# Altium schematic sheet BatteryCharger.SchDoc
size 420 x 297 mm; SheetNumber: 3; SheetTotal: 3
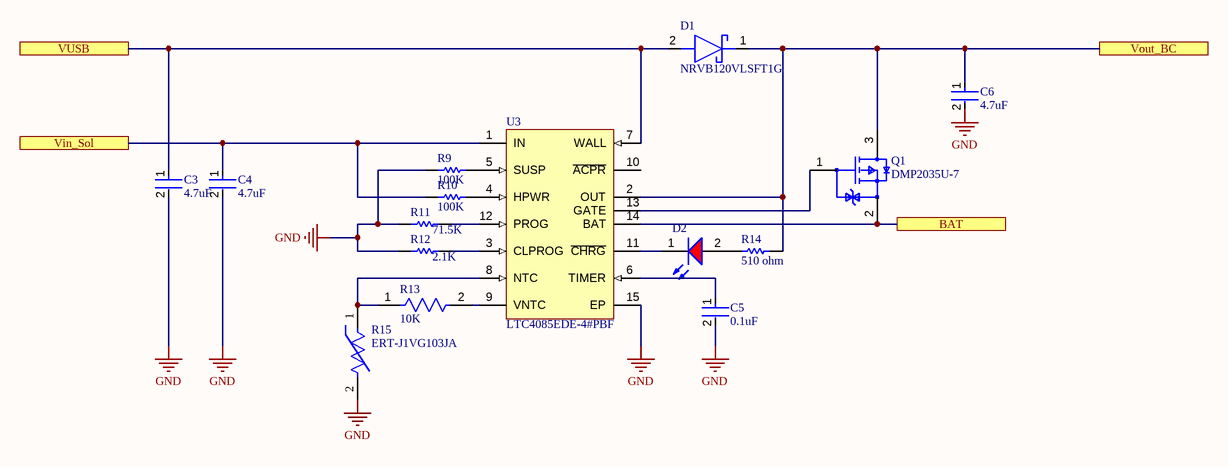
[diagram p0: BatteryCharger.SchDoc]

## Parts
C3  4.7uF  [FP-GRM188-0_15-IPC_A]
C4  4.7uF  [FP-GRM188-0_15-IPC_A]
C5  0.1uF  [FP-C0603C-CF-MFG]
C6  4.7uF  [FP-GRM188-0_15-IPC_A]
D1  NRVB120VLSFT1G  [SODFL3616X98N]
D2  (no value)  [WL-SMCW_0603_150060xx75000]
Q1  DMP2035U-7  [FP-SOT23-IPC_A]
R9  100K  [RESC1608X55X30ML20T10]
R10  100K  [RESC1608X55X30ML20T10]
R11  71.5K  [RESC1608X55X30NL15T15]
R12  2.1K  [RESC1608X55X30NL15T15]
R13  10K  [FP-RK73B1J-MFG]
R14  510 ohm  [RESC1608X55X30ML15T15]
R15  ERT-J1VG103JA  [FP-ERTJ1-IPC_C]
U3  LTC4085EDE-4#PBF  [LT-DE-14_V]

## Ports
BAT, Vin_Sol, Vout_BC, VUSB

## Nets
GND: C3.2 C4.2 C5.2 C6.2 R9.2 R11.1 R12.1 R15.2 U3.15(EP)
BAT: Q1.2(S) U3.14(BAT) ; port BAT
Vin_Sol: C4.1 R10.2 U3.1(IN) ; port Vin_Sol
Vout_BC: C6.1 D1.1(K) Q1.3(D) R14.2 U3.2(OUT) ; port Vout_BC
VUSB: C3.1 D1.2(A) U3.7(WALL) ; port VUSB
NetC5_1: C5.1 U3.6(TIMER)
NetD2_1: D2.1(K) U3.11(~{CHRG})
NetD2_2: D2.2(A) R14.1
NetQ1_1: Q1.1(G) U3.13(GATE)
NetR9_1: R9.1 U3.5(SUSP)
NetR10_1: R10.1 U3.4(HPWR)
NetR11_2: R11.2 U3.12(PROG)
NetR12_2: R12.2 U3.3(CLPROG)
NetR13_1: R13.1 R15.1 U3.8(NTC)
NetR13_2: R13.2 U3.9(VNTC)

Not connected (* = marked no-connect by the designer): U3 10(~{ACPR})

## Notes on the sheet
- THIS DOCUMENT AND THE DATA DISCLOSED HEREIN OR
- HEREWITH IS THE PROPERTY OF ALTIUM LIMITED AND MAY
- DWG NO:
- REVISION
- REV:
- DESCRIPTION
- DATE
- APPROVED
- BE FREELY DISTRIBUTED IN WHOLE. NO RIGHTS ARE
- RESERVED OR EXPRESS OR IMPLIED WARANTEE GIVEN.
- ENG:
- APPROVALS
- PROJECT
- DSN:
- CHK:
- REFERENCE DOCUMENTS
- PROJECT REVISION:
- TITLE
- DOCUMENT REVISION:
- DESIGN ITEM:
- BOM:
- FAB DWG:
- PCB DWG:
- ASSY DWG:
- SCALE:
- A3
- SIZE
- CAGE CODE
- FILE NAME
- DWG NO.
- SHEET
- OF
- REV

## Library data of the parts
C3 C4 C6 = CMP-06035-000034-2: CAP CER 4.7UF 10V X7S 0603; Material: Ceramic; Tolerance: 10%; Height: 0.8mm; Termination: SMD/SMT; Case Code (Metric): 1608; Voltage Rating: 10V; Width: 0.8mm; Resistor Type: Ceramic; Length: 1.6mm; Voltage Rating (DC): 10V; Weight: 0.000222oz; Dielectric: X7S; Package Quantity: 4000; Mount: Surface Mount; Case Code (Imperial): 0603; Case/Package: 0603; Packaging: Tape and Reel; Thickness: 0.037inch; Min Operating Temperature: -55°C; Capacitance: 4.7uF; Max Operating Temperature: 125°C
C5 = CMP-2006-03061-2: CAP CER 0.1UF 50V X7R 0603; Manufacturer: KEMET; Manufacturer Part Number: C0603C104K5RACTU; Tolerance: 0.1; Temperature Coefficient: 30ppm/°C; Material: Ceramic; Automotive Grade: Grade 1; Value: 0.10 μF; Temperature: -55°C to +125°C; RoHS: TRUE; Temperature Range High: +125°C; Lead Free: Yes; Octopart: https://octopart.com/c0603c104k5ractu-kemet-139244; Digikey Description: CAP CER 0.1UF 50V X7R 0603; Category: Cap; Package: C0603C-CF; ComponentLink2Description: Datasheet; Temperature Range Low: -55°C; Device Class L1: Passive Components; Voltage Rating: 50 V; Automotive: Yes; Device Class L3: Ceramic Capacitors; ComponentLink2URL: https://api.kemet.com/component-edge/download/datasheet/C0603C100J5GACAUTO.pdf; Capacitance: 0.10 μF; Device Class L2: Capacitors; Temperature Characteristic: X7R; Height: 0.87mm
D1 = NRVB120VLSFT1G: Schottky Diode; Manufacturer_Name: onsemi; Datasheet Link: https://www.onsemi.com/pub/Collateral/MBR120VLSFT1-D.PDF; Height: 0.98mm; Manufacturer_Part_Number: NRVB120VLSFT1G; Mouser Part Number: 863-NRVB120VLSFT1G; Mouser Price/Stock: https://www.mouser.co.uk/ProductDetail/onsemi/NRVB120VLSFT1G?qs=tCMd4XlZ%2FiDc2vkUzw3hig%3D%3D; Arrow Part Number: NRVB120VLSFT1G; Arrow Price/Stock: null?utm_currency=USD&region=nac
D2 = CMP-1426-00001-4: LED Low-Power Uni-Color Red 630nm 2V 2-Pin Chip 0603(1608Metric) T/R; Max Junction Temperature (Tj): 95°C; Dominant Wavelength: 625nm; Lens Style: Clear, Rectangular; Viewing Angle: 140°; Forward Current: 100mA; Max Reverse Voltage (DC): 5V; Luminous Intensity: 250mcd; Test Current: 20mA; Power Dissipation: 72mW; Max Operating Temperature: 85°C; Mount: Surface Mount; Height: 700µm; Packaging: Tape and Reel; REACH SVHC: Unknown; Case Code (Metric): 1608; Peak Wavelength: 630nm; Forward Voltage: 2V; Case/Package: 0603; Color: Red; RoHS: Compliant; Width: 800µm; Reverse Voltage: 5V; Min Operating Temperature: -40°C; Wavelength: 625nm; Case Code (Imperial): 0603; Length: 1.6mm
Q1 = CMP-2000-06174-3: MOSFET P-CH 20V 3.6A SOT-23; Gate to Source Voltage (Vgs): 8V; Input Capacitance: 1.61nF; Rise Time: 12.4ns; On-State Resistance: 62mR; Turn-On Delay Time: 16.8ns; Element Configuration: Single; Turn-Off Delay Time: 94.1ns; Drain to Source Resistance: 23mR; Number of Channels: 1; Fall Time: 42.4ns; Rds On Max: 35mR; Drain to Source Breakdown Voltage: -20V; Power Dissipation: 810mW; Package Quantity: 3000; Max Operating Temperature: 150°C; REACH SVHC: No SVHC; Min Operating Temperature: -55°C; Contact Plating: Tin; Height: 1.1mm; Width: 1.4mm; Mount: Surface Mount; Length: 3mm; Lead Free: Lead Free; Number of Pins: 3; Continuous Drain Current (ID): 3.6A; Drain to Source Voltage (Vdss): 20V; Weight: 0.000282oz; Radiation Hardening: No; Number of Elements: 1; Case/Package: SOT-23-3; Max Power Dissipation: 810mW; Packaging: Tape and Reel
R9 R10 = CMP-2000-01852-1: Part Number: RK73B1JTTD104J; Manufacturer: KOA Speer
R11 = CMP-2000-00629-1: Part Number: ERJ-3EKF7152V; Manufacturer: Panasonic
R12 = CMP-2000-00327-1: Part Number: ERJ-3EKF2101V; Manufacturer: Panasonic
R13 = CMP-2000-01851-2: RES 10K OHM 5% 1/10W 0603; Temperature Coefficient: 200ppm/°C; Voltage Rating: 50V; Power Rating: 100mW; Resistance: 10kR; Length: 1.6mm; Lead Free: Lead Free; Resistance Tolerance: 5%; Case Code (Metric): 1608; Width: 0.8mm; Height: 0.45mm; Max Operating Temperature: 155°C; RoHS Compliant: Yes; Resistor Type: Thick Film; Min Operating Temperature: -55°C; Case Code (Imperial): 0603; Technology: THICK FILM; Package Quantity: 5000; Tolerance: 5%; Case/Package: 0603; Voltage Rating (DC): 50V; Depth: 0.8mm; Packaging: Tape and Reel; Number of Pins: 2; Construction: Rectangular; Series: RK73B; Military Standard: Not; Termination: SMD/SMT
R14 = CMP-2000-00802-1: Manufacturer: Panasonic; Part Number: ERJ-3GEYJ511V
R15 = CMP-05419-000002-1: THERMISTOR NTC 10KOHM 3380K 0603; Tolerance: 5%; Resistance: 10kR; Max Power Dissipation: 100mW; Accuracy: 1%; Case Code (Metric): 1608; Lead Free: Lead Free; Max Operating Temperature: 125°C; Termination: SMD/SMT; Radiation Hardening: No; Series: ERT-J; Length: 1.6mm; Depth: 0.8mm; RoHS Compliant: Yes; Number of Pins: 2; Case/Package: 0603; Packaging: Tape and Reel; Width: 800um; REACH SVHC: No SVHC; Min Operating Temperature: -40°C; Package Quantity: 4000; Case Code (Imperial): 0603; Resistance Tolerance: 5%; Mount: Surface Mount
U3 = CMP-0478-00063-1: USB Power Manager with Ideal Diode Controller and 3.95 V Li-Ion Charger, 32.6% Vvntc, No Undervoltage Current Limit, 4.35 to 5.5 V Vin, 14-pin SON (DE-14), -40 to 85 degC, Pb-Free; Manufacturer: Linear Technology; Vin Min(V): 4.35; Number of Outputs: 1; Vin Max(V): 5.5; PackageReference: DE-14; DatasheetVersion: Rev. B; ComponentLink1Description: Manufacturer URL; PackageVersion: Rev. B, 06/2010; Number of Cells: 1; ComponentLink3Description: Package Specification; ComponentLink1URL: http://www.linear.com/; ComponentLink3URL: http://www.linear.com/docs/en/packaging/DFN_14_05-08-1708.pdf; ComponentLink2URL: http://cds.linear.com/docs/en/datasheet/408534fb.pdf; PartNumber: LTC4085EDE-4#PBF; Code_JEDEC: MO-229; ComponentLink2Description: Datasheet; RoHS: TRUE; PackageDescription: 14-Pin Plastic DFN, Body 4 x 3 mm, Pitch 0.5 mm; Mounting Technology: Surface Mount